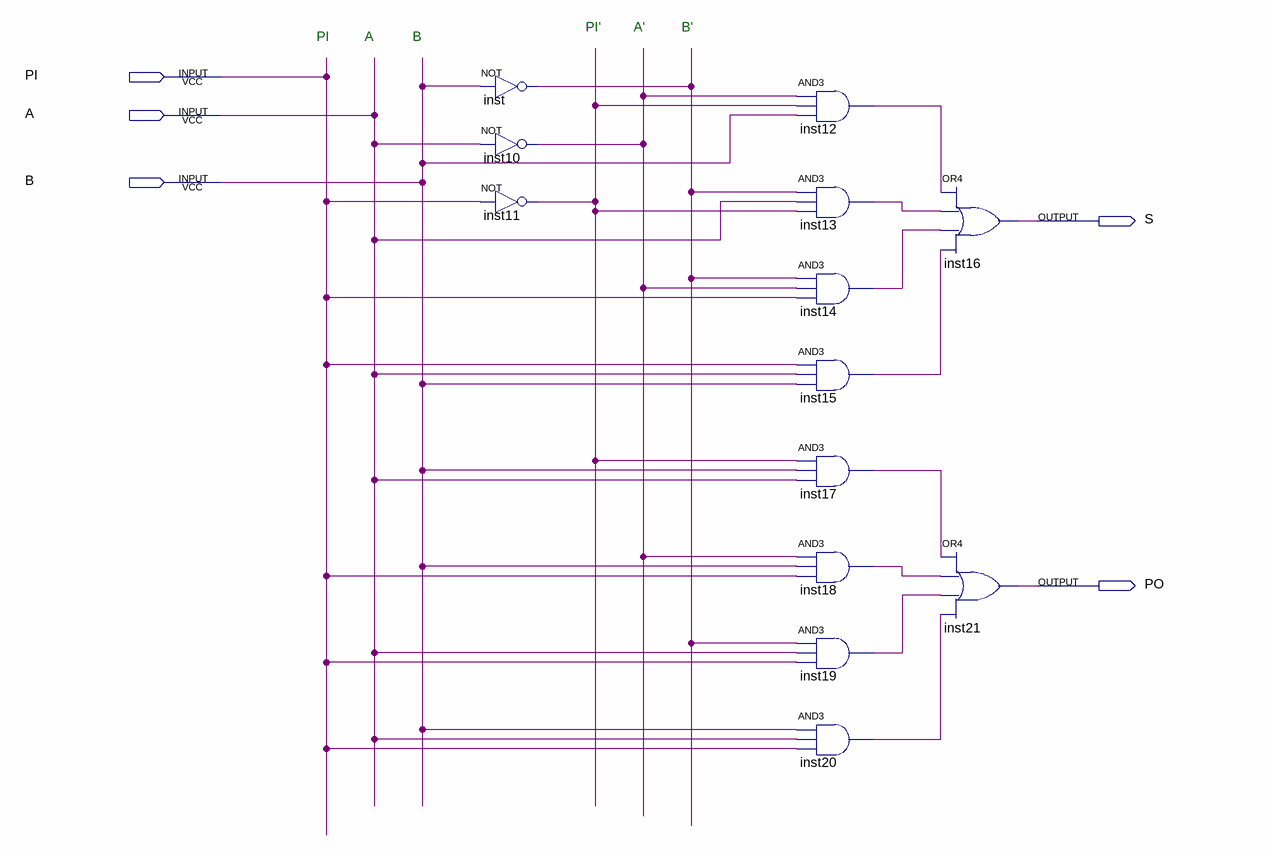
[diagram p0: schematic sheet]
// Quartus schematic CMB5.bdf as structural Verilog: 13 symbols, 5 pins
module CMB5 (
  input  PI,
  input  A,
  input  B,
  output S,
  output PO
);

  wire inst10_out, inst11_out, inst12_out, inst13_out, inst14_out, inst15_out, inst17_out, inst18_out,
       inst19_out, inst20_out, inst_out;

  not inst (inst_out, B);
  not inst10 (inst10_out, A);
  not inst11 (inst11_out, PI);
  and inst12 (inst12_out, inst10_out, inst11_out, B);
  and inst13 (inst13_out, inst_out, A, inst11_out);
  and inst14 (inst14_out, inst_out, inst10_out, PI);
  and inst15 (inst15_out, PI, A, B);
  and inst17 (inst17_out, inst11_out, B, A);
  and inst18 (inst18_out, inst10_out, B, PI);
  and inst19 (inst19_out, inst_out, A, PI);
  and inst20 (inst20_out, B, A, PI);
  or inst16 (S, inst12_out, inst13_out, inst14_out, inst15_out);
  or inst21 (PO, inst17_out, inst18_out, inst19_out, inst20_out);

  // Notes on the sheet:
  //   PI'
  //   A'
  //   B'
  //   PI
  //   A
  //   B
endmodule
